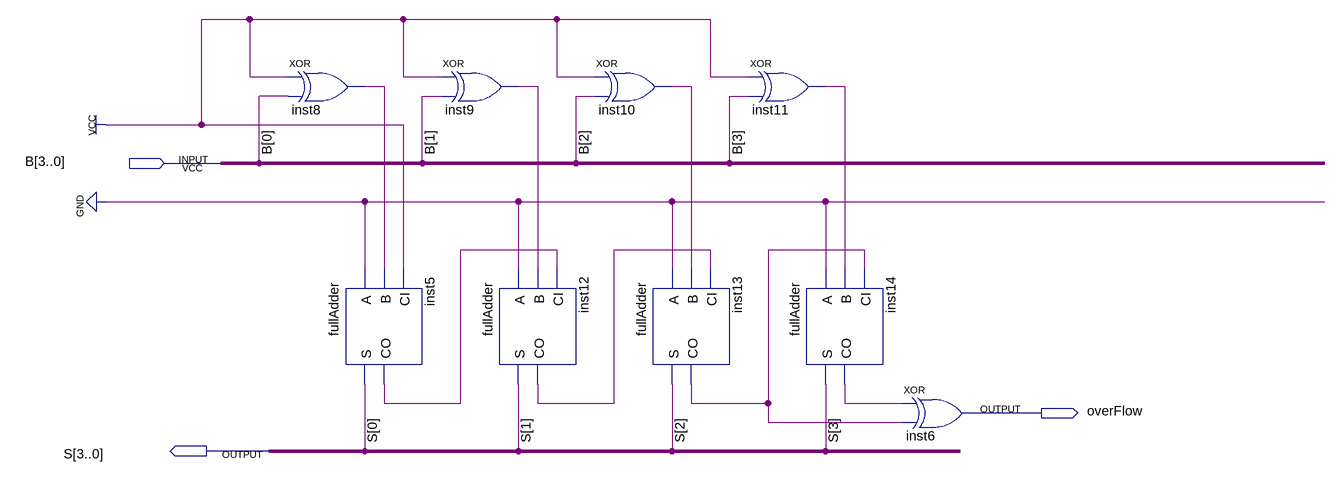
[diagram p0: schematic sheet]
// Quartus schematic complemento2.bdf as structural Verilog: 9 symbols, 3 pins
module complemento2 (
  input  [3:0] B,
  output overFlow,
  output [3:0] S
);

  wire inst5_co, inst8_out, inst9_out, inst10_out, inst11_out, inst12_co, inst13_co, inst14_co;

  xor inst8 (inst8_out, 1'b1, B[0]);
  fullAdder inst5 (.A(1'b0), .B(inst8_out), .CI(1'b1), .S(S[0]), .CO(inst5_co));
  xor inst9 (inst9_out, 1'b1, B[1]);
  fullAdder inst12 (.A(1'b0), .B(inst9_out), .CI(inst5_co), .S(S[1]), .CO(inst12_co));
  xor inst10 (inst10_out, 1'b1, B[2]);
  fullAdder inst13 (.A(1'b0), .B(inst10_out), .CI(inst12_co), .S(S[2]), .CO(inst13_co));
  xor inst11 (inst11_out, 1'b1, B[3]);
  fullAdder inst14 (.A(1'b0), .B(inst11_out), .CI(inst13_co), .S(S[3]), .CO(inst14_co));
  xor inst6 (overFlow, inst14_co, inst13_co);
endmodule
